# Altium schematic sheet 03-SROM.SchDoc
size A4; SheetNumber: 3; SheetTotal: 4
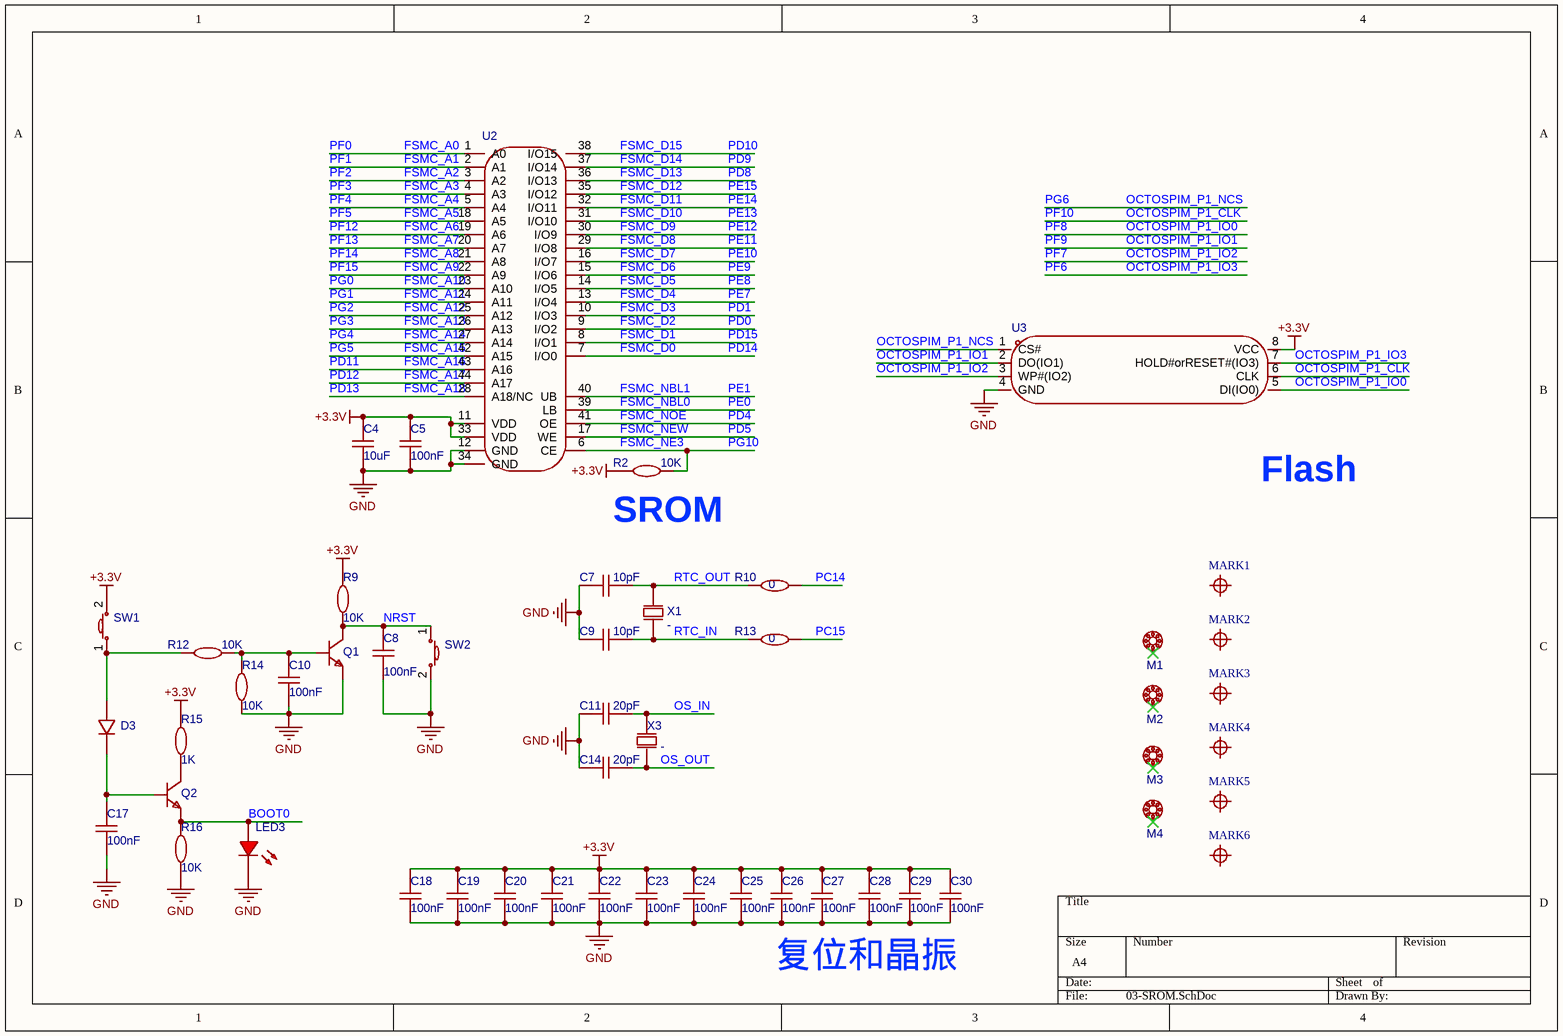
[diagram p0: 03-SROM.SchDoc]

## Parts
C4  value 10uF  [C0603]  (hidden comment: CAP_0603)
C5  value 100nF  [C0603]  (hidden comment: CAP_0603)
C7  value 10pF  [C0603]  (hidden comment: CAP_0603)
C8  value 100nF  [C0603]  (hidden comment: CAP_0603)
C9  value 10pF  [C0603]  (hidden comment: CAP_0603)
C10  value 100nF  [C0603]  (hidden comment: CAP_0603)
C11  value 20pF  [C0603]  (hidden comment: CAP_0603)
C14  value 20pF  [C0603]  (hidden comment: CAP_0603)
C17  value 100nF  [C0603]  (hidden comment: CAP_0603)
C18  value 100nF  [C0603]  (hidden comment: CAP_0603)
C19  value 100nF  [C0603]  (hidden comment: CAP_0603)
C20  value 100nF  [C0603]  (hidden comment: CAP_0603)
C21  value 100nF  [C0603]  (hidden comment: CAP_0603)
C22  value 100nF  [C0603]  (hidden comment: CAP_0603)
C23  value 100nF  [C0603]  (hidden comment: CAP_0603)
C24  value 100nF  [C0603]  (hidden comment: CAP_0603)
C25  value 100nF  [C0603]  (hidden comment: CAP_0603)
C26  value 100nF  [C0603]  (hidden comment: CAP_0603)
C27  value 100nF  [C0603]  (hidden comment: CAP_0603)
C28  value 100nF  [C0603]  (hidden comment: CAP_0603)
C29  value 100nF  [C0603]  (hidden comment: CAP_0603)
C30  value 100nF  [C0603]  (hidden comment: CAP_0603)
D3  LL4148_C9808  [LL-34_L3.5-W1.5-RD]  (value not drawn)
LED3  LED_0603-R  [LED_0603]  (value not drawn)
M1  M3螺丝  [Screw]  (value not drawn)
M2  M3螺丝  [Screw]  (value not drawn)
M3  M3螺丝  [Screw]  (value not drawn)
M4  M3螺丝  [Screw]  (value not drawn)
MARK1  Mark-Point  [Mark-Point]  (value not drawn)
MARK2  Mark-Point  [Mark-Point]  (value not drawn)
MARK3  Mark-Point  [Mark-Point]  (value not drawn)
MARK4  Mark-Point  [Mark-Point]  (value not drawn)
MARK5  Mark-Point  [Mark-Point]  (value not drawn)
MARK6  Mark-Point  [Mark-Point]  (value not drawn)
Q1  S8050_SOT_NPN  [S8050_SOT-23]  (value not drawn)
Q2  S8050_SOT_NPN  [S8050_SOT-23]  (value not drawn)
R2  value 10K  [R0603]  (hidden comment: Res_0603)
R9  value 10K  [R0603]  (hidden comment: Res_0603)
R10  value 0  [R0402]  (hidden comment: Res_0402)
R12  value 10K  [R0603]  (hidden comment: Res_0603)
R13  value 0  [R0402]  (hidden comment: Res_0402)
R14  value 10K  [R0603]  (hidden comment: Res_0603)
R15  value 1K  [R0603]  (hidden comment: Res_0603)
R16  value 10K  [R0603]  (hidden comment: Res_0603)
SW1  (no value)  [Key_SMD_3.6x6.1x2.5]
SW2  (no value)  [Key_SMD_3.6x6.1x2.5]
U2  IS62WV51216  [TSOP-44]  (value not drawn)
U3  W25Q128JVSIQ_C113767  [SOIC-8_L5.3-W5.3-P1.27-LS8.0-BL]  (value not drawn)
X1  1TD125BFNS001  [OSC-TH_BD2.1-P0.70-D0.3]  (value not drawn)
X3  9C08000003  [HC-49S_L11.4-W4.8]  (value not drawn)

## Nets
+3.3V: C4.2 C5.2 C18.2 C19.2 C20.2 C21.2 C22.2 C23.2 C24.2 C25.2 C26.2 C27.2 C28.2 C29.2 C30.2 R2.2 R9.2 R15.2 SW1.2 U2.11(VDD) U2.33(VDD) U3.8(VCC)
GND: C4.1 C5.1 C7.1 C8.1 C9.1 C10.1 C11.1 C14.1 C17.1 C18.1 C19.1 C20.1 C21.1 C22.1 C23.1 C24.1 C25.1 C26.1 C27.1 C28.1 C29.1 C30.1 LED3.1(C) Q1.2 R14.1 R16.1 SW2.2 U2.12(GND) U2.34(GND) U3.4(GND)
BOOT0: LED3.2(A) Q2.2 R16.2
FSMC_A0: U2.1(A0)  [also labelled PF0]
FSMC_A1: U2.2(A1)  [also labelled PF1]
FSMC_A2: U2.3(A2)  [also labelled PF2]
FSMC_A3: U2.4(A3)  [also labelled PF3]
FSMC_A4: U2.5(A4)  [also labelled PF4]
FSMC_A5: U2.18(A5)  [also labelled PF5]
FSMC_A6: U2.19(A6)  [also labelled PF12]
FSMC_A7: U2.20(A7)  [also labelled PF13]
FSMC_A8: U2.21(A8)  [also labelled PF14]
FSMC_A9: U2.22(A9)  [also labelled PF15]
FSMC_A10: U2.23(A10)  [also labelled PG0]
FSMC_A11: U2.24(A11)  [also labelled PG1]
FSMC_A12: U2.25(A12)  [also labelled PG2]
FSMC_A13: U2.26(A13)  [also labelled PG3]
FSMC_A14: U2.27(A14)  [also labelled PG4]
FSMC_A15: U2.42(A15)  [also labelled PG5]
FSMC_A16: U2.43(A16)  [also labelled PD11]
FSMC_A17: U2.44(A17)  [also labelled PD12]
FSMC_A18: U2.28(A18/NC)  [also labelled PD13]
FSMC_D0: U2.7(I/O0)  [also labelled PD14]
FSMC_D1: U2.8(I/O1)  [also labelled PD15]
FSMC_D2: U2.9(I/O2)  [also labelled PD0]
FSMC_D3: U2.10(I/O3)  [also labelled PD1]
FSMC_D4: U2.13(I/O4)  [also labelled PE7]
FSMC_D5: U2.14(I/O5)  [also labelled PE8]
FSMC_D6: U2.15(I/O6)  [also labelled PE9]
FSMC_D7: U2.16(I/O7)  [also labelled PE10]
FSMC_D8: U2.29(I/O8)  [also labelled PE11]
FSMC_D9: U2.30(I/O9)  [also labelled PE12]
FSMC_D10: U2.31(I/O10)  [also labelled PE13]
FSMC_D11: U2.32(I/O11)  [also labelled PE14]
FSMC_D12: U2.35(I/O12)  [also labelled PE15]
FSMC_D13: U2.36(I/O13)  [also labelled PD8]
FSMC_D14: U2.37(I/O14)  [also labelled PD9]
FSMC_D15: U2.38(I/O15)  [also labelled PD10]
FSMC_NBL0: U2.39(LB)  [also labelled PE0]
FSMC_NBL1: U2.40(UB)  [also labelled PE1]
FSMC_NE3: R2.1 U2.6(CE)  [also labelled PG10]
FSMC_NEW: U2.17(WE)  [also labelled PD5]
FSMC_NOE: U2.41(OE)  [also labelled PD4]
NRST: C8.2 Q1.3 R9.1 SW2.1
OCTOSPIM_P1_CLK: U3.6(CLK)  [also labelled PF10]
OCTOSPIM_P1_IO0: U3.5(DI(IO0))  [also labelled PF8]
OCTOSPIM_P1_IO1: U3.2(DO(IO1))  [also labelled PF9]
OCTOSPIM_P1_IO2: U3.3(WP#(IO2))  [also labelled PF7]
OCTOSPIM_P1_IO3: U3.7(HOLD#orRESET#(IO3))  [also labelled PF6]
OCTOSPIM_P1_NCS: U3.1(CS#)  [also labelled PG6]
OS_IN: C11.2 X3.2(OSC2)
OS_OUT: C14.2 X3.1(OSC1)
PC14: R10.2
PC15: R13.2
RTC_IN: C9.2 R13.1 X1.2(OSC2)
RTC_OUT: C7.2 R10.1 X1.1(OSC1)
NetC10_2: C10.2 Q1.1 R12.2 R14.2
NetC17_2: C17.2 D3.1(K) Q2.1
NetD3_2: D3.2(A) R12.1 SW1.1
NetQ2_3: Q2.3 R15.1

Not connected (* = marked no-connect by the designer): M1 1*; M2 1*; M3 1*; M4 1*; MARK1 1; MARK2 1; MARK3 1; MARK4 1; MARK5 1; MARK6 1

## Notes on the sheet
- Flash
- (near R2) SROM
- 复位和晶振

## Library data of the parts
C4 C5 C7-C11 C14 C17-C30 = CAP_0603: ConvertToPcb: yes; SymbolName: CapAcitance; ModelId: ac125912035d415993ca9572d50418b1; ModelName: C0603_L1.6-W0.8-H0.8; ModelTransform: 62.992,31.496,0,0,0,0,0,0,0; Device: CAP_0603; AddInBom: yes; Supplier Footprint: 0603; FootprintName: C0603
D3 = LL4148_C9808: 二极管配置:-;功率:500mW;直流反向耐压(Vr):75V;平均整流电流(Io):200mA;正向压降(Vf):1V@10mA;反向电流(Ir):5uA@75V;反向恢复时间(trr):4ns;工作温度:+175℃@(Tj);; Manufacturer: ST(先科); Symbol: LL4148; AddInBom: yes; ModelId: 4a6f2309ca4c4217857da1816cccdf69; ModelName: LL-34_L3.5-W1.5; ModelTransform: 133.93674,59.031,0,0,0,0,0,0,0; Power Dissipation: 500mW; Reverse Voltage (Vr): 75V; Average Rectified Current (Io): 200mA; Reverse Recovery Time (trr): 4ns; Device: LL4148_C9808; LCSC Part Name: 75V 200mA 4ns; SupplierPart: C9808; ManufacturerPart: LL4148; Supplier Footprint: LL-34; JLCPCB Part Class: Basic Part; Datasheet: https://atta.szlcsc.com/upload/public/pdf/source/20121108/1457706554347.pdf; Supplier: LCSC; ConvertToPcb: yes; FootprintName: LL-34_L3.5-W1.5-RD; Diode Configuration: -; Forward Voltage (Vf@If): 1V@10mA; Reverse Leakage Current: 5uA@75V; Operating Temperature: +175℃@(Tj)
LED3 = LED_0603-R: Symbol: LED_R; Convert to PCB: yes; 3D Model: dd8257b0d61a4cd7b68939a056e08095; 3D Model Transform: 58.72,29.4,22.03,0,0,0,0,0,0; ModelName: LED-0603_R; Device: LED_0603-R; Add into BOM: yes; Supplier Footprint: 0603; FootprintName: LED_0603
M1-M4 = M3螺丝: AddInBom: yes; Pin Type: IN; Device: M3螺丝; ConvertToPcb: yes; SymbolName: M3螺丝; FootprintName: 螺钉孔
MARK1-MARK6 = Mark-Point: Add into BOM: no; Convert to PCB: yes; Symbol: Mark-Point; Device: Mark-Point
Q1 Q2 = S8050_SOT_NPN: ConvertToPcb: yes; SymbolName: NPN; ModelId: c62791f0466c4ae2a892c056b845b0ca; ModelName: SOT-23-3P_L2.9-W1.3-H1.0-LS2.4-P0.95; ModelTransform: 98.6,114.12,41.29,180,0,0,0,0,-3; Device: S8050_SOT_NPN; AddInBom: yes; Supplier Footprint: SOT-23; FootprintName: S8050_SOT-23
R2 R9 R12 R14-R16 = Res_0603: Symbol: 电阻; ConvertToPcb: yes; ModelId: fc143cca1e79419f9cd78b61e9279f08; ModelTransform: 31.8897,63.7794,0,90,0,0,0,0,0; Device: Res_0603; AddInBom: yes; Supplier Footprint: 0603; FootprintName: R0603; ModelName: R0603
R10 R13 = Res_0402: Symbol: 电阻; ConvertToPcb: yes; ModelId: 671aefced39d4c318694bba8bd8efd39; ModelName: R0402_L1.0-W0.5-H0.5; ModelTransform: 39.37,19.685,0,0,0,0,0,0.0005,0; Device: Res_0402; AddInBom: yes; Supplier Footprint: 0402; FootprintName: R0402
SW1 SW2 = Key_SMD_3.6x6.1x2.5: SymbolName: 轻触按键x2; AddInBom: yes; ModelId: 90d18ad19a7e424ebd3215e1b5dcb80c聨0819f05c4eef4c71ace90d822a990e87; ModelName: KEY-SMD_2P-L6.0-W3.6-H2.5-LS8.0 COPY; ModelTransform: 311.02,141.73,102.36,0,0,0,0,0,0; Device: Key_SMD_3.6x6.1x2.5; ConvertToPcb: yes; FootprintName: Key_SMD_3.6x6.1x2.5; Supplier Footprint: SMD
U2 = IS62WV51216: Pin Type: IN; AddInBom: yes; Symbol: IS62WV51216; Device: IS62WV51216; ConvertToPcb: yes; OriginFootprint: TSOP-44; FootprintName: TSOP-44
U3 = W25Q128JVSIQ_C113767: Manufacturer: WINBOND(华邦); AddInBom: yes; ModelId: f83d990ad74f400caf5ac920b7771508; ModelName: SOIC-8_L5.3-W5.3-H1.9-LS7.9-P1.27; ModelTransform: 208.661,311.25654,0,0,0,0,-0.0005,0.0005,0; Symbol: W25Q128JVSIQ; Device: W25Q128JVSIQ_C113767; LCSC Part Name: W25Q128JVSIQ; SupplierPart: C113767; ManufacturerPart: W25Q128JVSIQ; Supplier Footprint: SOIC-8-208mil; JLCPCB Part Class: 扩展库; Datasheet: https://atta.szlcsc.com/upload/public/pdf/source/20180329/C113767_097B64D788F6E3FFB2E9CB46CB6C1427.pdf; Supplier: LCSC; ConvertToPcb: yes; FootprintName: SOIC-8_L5.3-W5.3-P1.27-LS8.0-BL
X1 = 1TD125BFNS001: 频率:-;负载电容:-;; Manufacturer: KDS(大真空); AddInBom: yes; ModelId: bf3d0483db0e46329f34fee1250cddf8; ModelName: OSC-TH_BD2.1-H6.0-P1.0-D0.3; ModelTransform: 291.7317,75.59,0,0,0,0,-141.733,0.003,-137.795; Symbol: 1TD125BFNS001; Value: -; Device: 1TD125BFNS001; LCSC Part Name: DT-26 32.768K 10PPM 12.5PF 袋装/盒装 袋装/盒装; SupplierPart: C213419; ManufacturerPart: 1TD125BFNS001; Supplier Footprint: DT-26; JLCPCB Part Class: 扩展库; Datasheet: https://atta.szlcsc.com/upload/public/pdf/source/20180530/C213419_C8E01C2F1F46F9420141CAE391D7F4A5.pdf; Supplier: LCSC; ConvertToPcb: yes; FootprintName: OSC-TH_BD2.1-P0.70-D0.3; Crystal Type: -; Load Capacitance: -; Operating Temperature: -
X3 = 9C08000003: 频率:-;负载电容:-;; Manufacturer: TXC(晶技); Symbol: 9C0803LCSC-DDK2S; AddInBom: yes; ModelId: 6f569b91267b44029b8615eb5c810fba; ModelName: HC-49S_L11.4-W1.8-H3.0-LS12.7; ModelTransform: 499.999,188.976,0,0,0,0,0,0,0; Value: -; Device: 9C08000003; LCSC Part Name: HC-49SMD 8M 20pF 20ppm; SupplierPart: C90937; ManufacturerPart: 9C08000003; Supplier Footprint: HC-49S-SMD; JLCPCB Part Class: Extended Part; Datasheet: https://atta.szlcsc.com/upload/public/pdf/source/20161217/1481939207740.pdf; Supplier: LCSC; ConvertToPcb: yes; FootprintName: HC-49S_L11.4-W4.8; Crystal Type: -; Load Capacitance: -; Operating Temperature: -